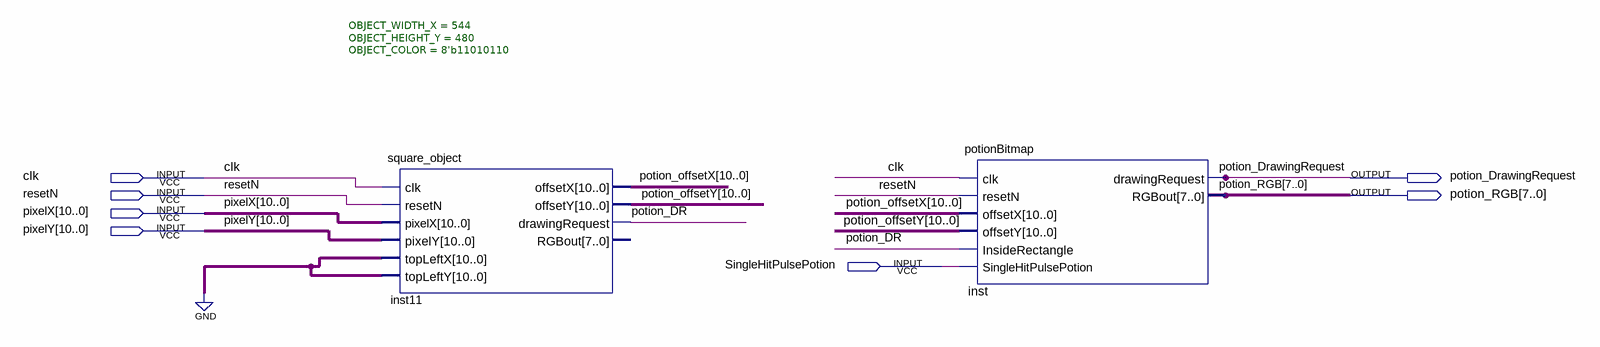
[diagram p0: schematic sheet]
// Quartus schematic POTION_DISPLAY.bdf as structural Verilog: 2 symbols, 7 pins
module POTION_DISPLAY (
  input  clk,
  input  resetN,
  input  [10:0] pixelX,
  input  [10:0] pixelY,
  input  SingleHitPulsePotion,
  output potion_DrawingRequest,
  output [7:0] potion_RGB
);

  wire potion_DR;
  wire [10:0] potion_offsetX, potion_offsetY;

  square_object #(.OBJECT_WIDTH_X(544), .OBJECT_HEIGHT_Y(480), .OBJECT_COLOR(8'b11010110)) inst11 (
    .clk(clk), .resetN(resetN), .pixelX(pixelX), .pixelY(pixelY), .topLeftX({11{1'b0}}),
    .topLeftY({11{1'b0}}), .offsetX(potion_offsetX), .offsetY(potion_offsetY), .drawingRequest(potion_DR));  // open: RGBout
  potionBitmap inst (
    .clk(clk), .resetN(resetN), .offsetX(potion_offsetX), .offsetY(potion_offsetY),
    .InsideRectangle(potion_DR), .SingleHitPulsePotion(SingleHitPulsePotion),
    .drawingRequest(potion_DrawingRequest), .RGBout(potion_RGB));
endmodule
